# EAGLE schematic shinobi (EAGLE 9.6.2)
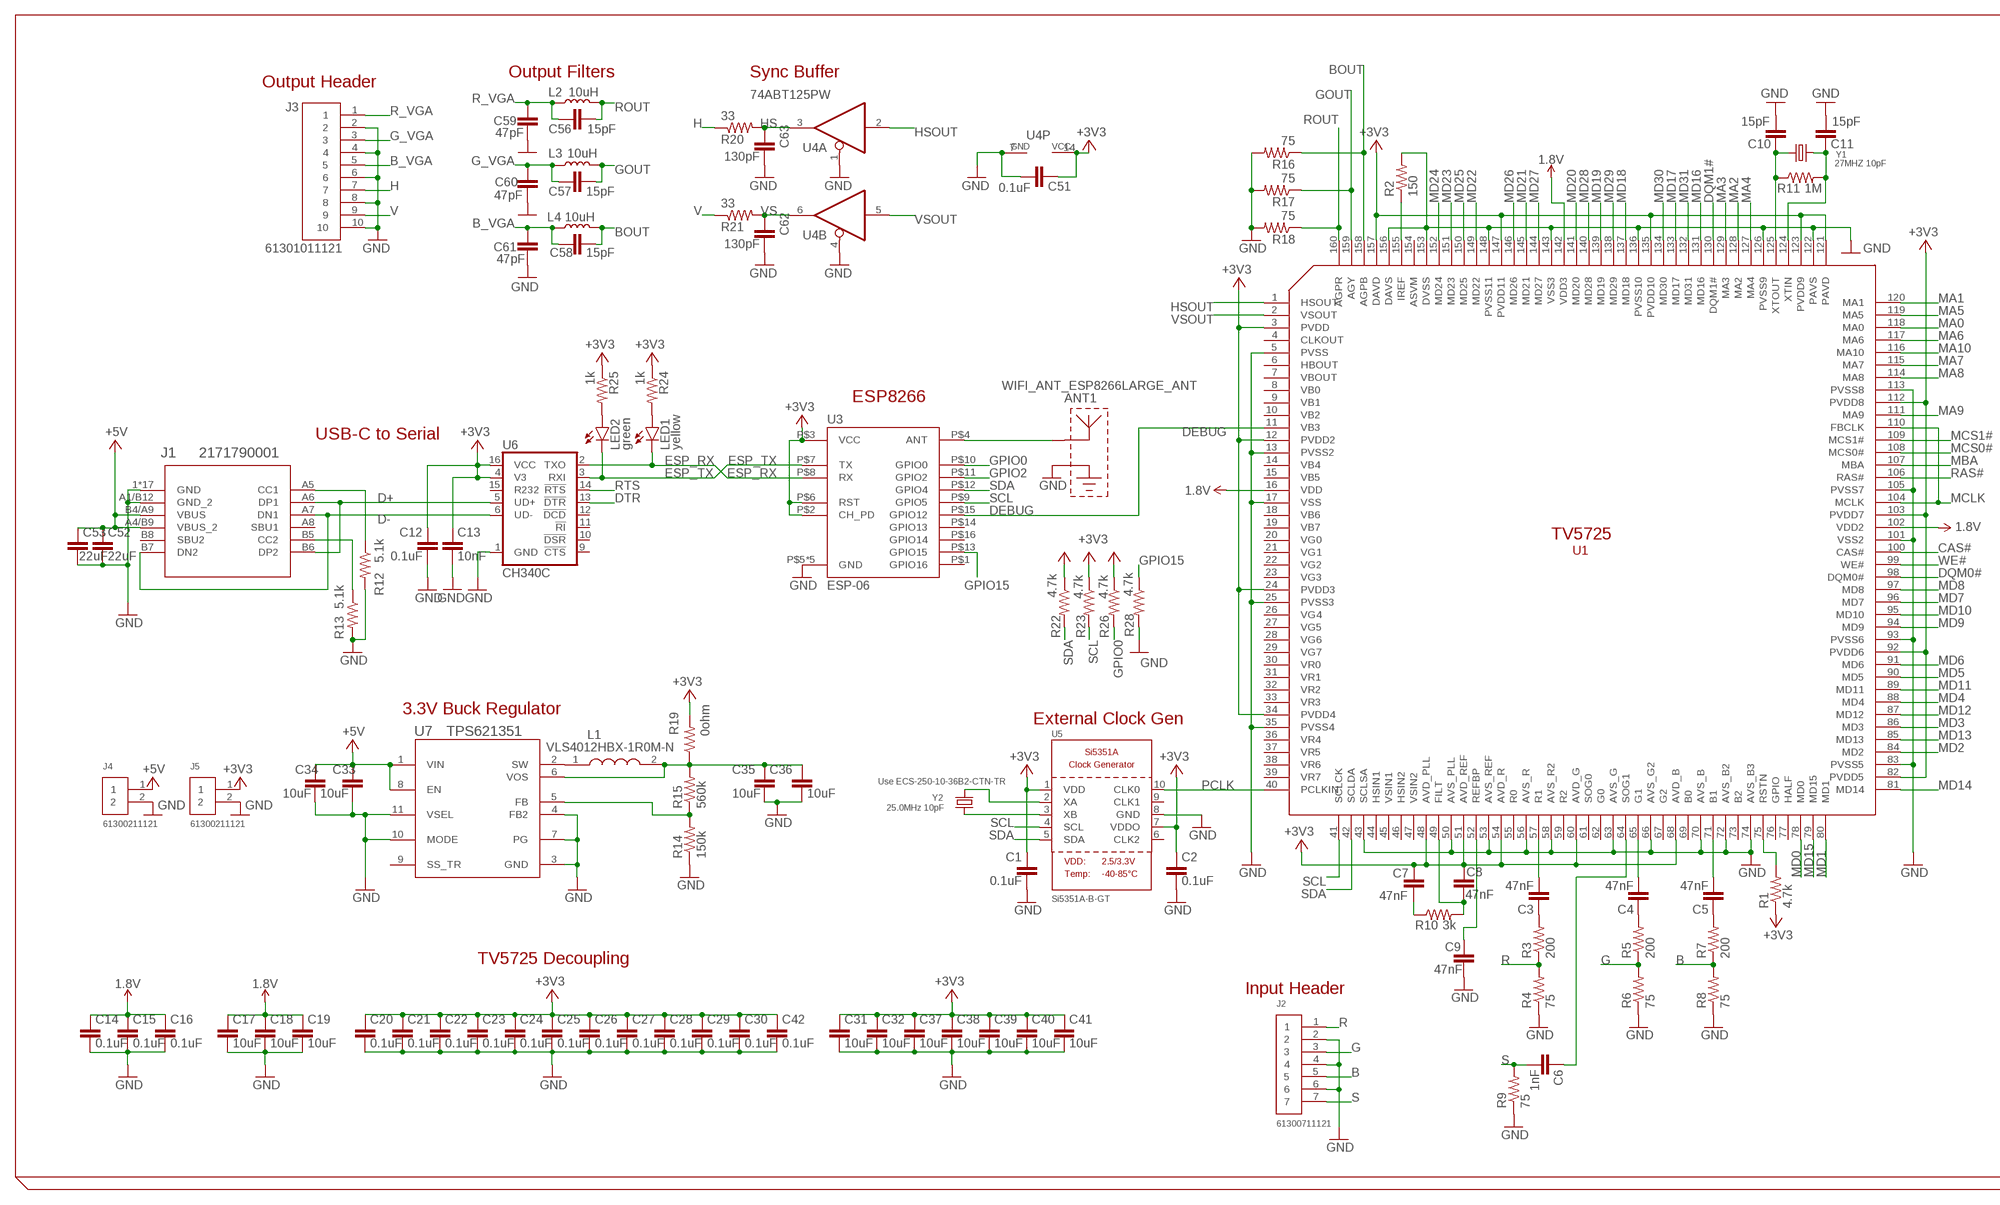
[diagram p0: schematic, sheet 1, part 1 of 2]
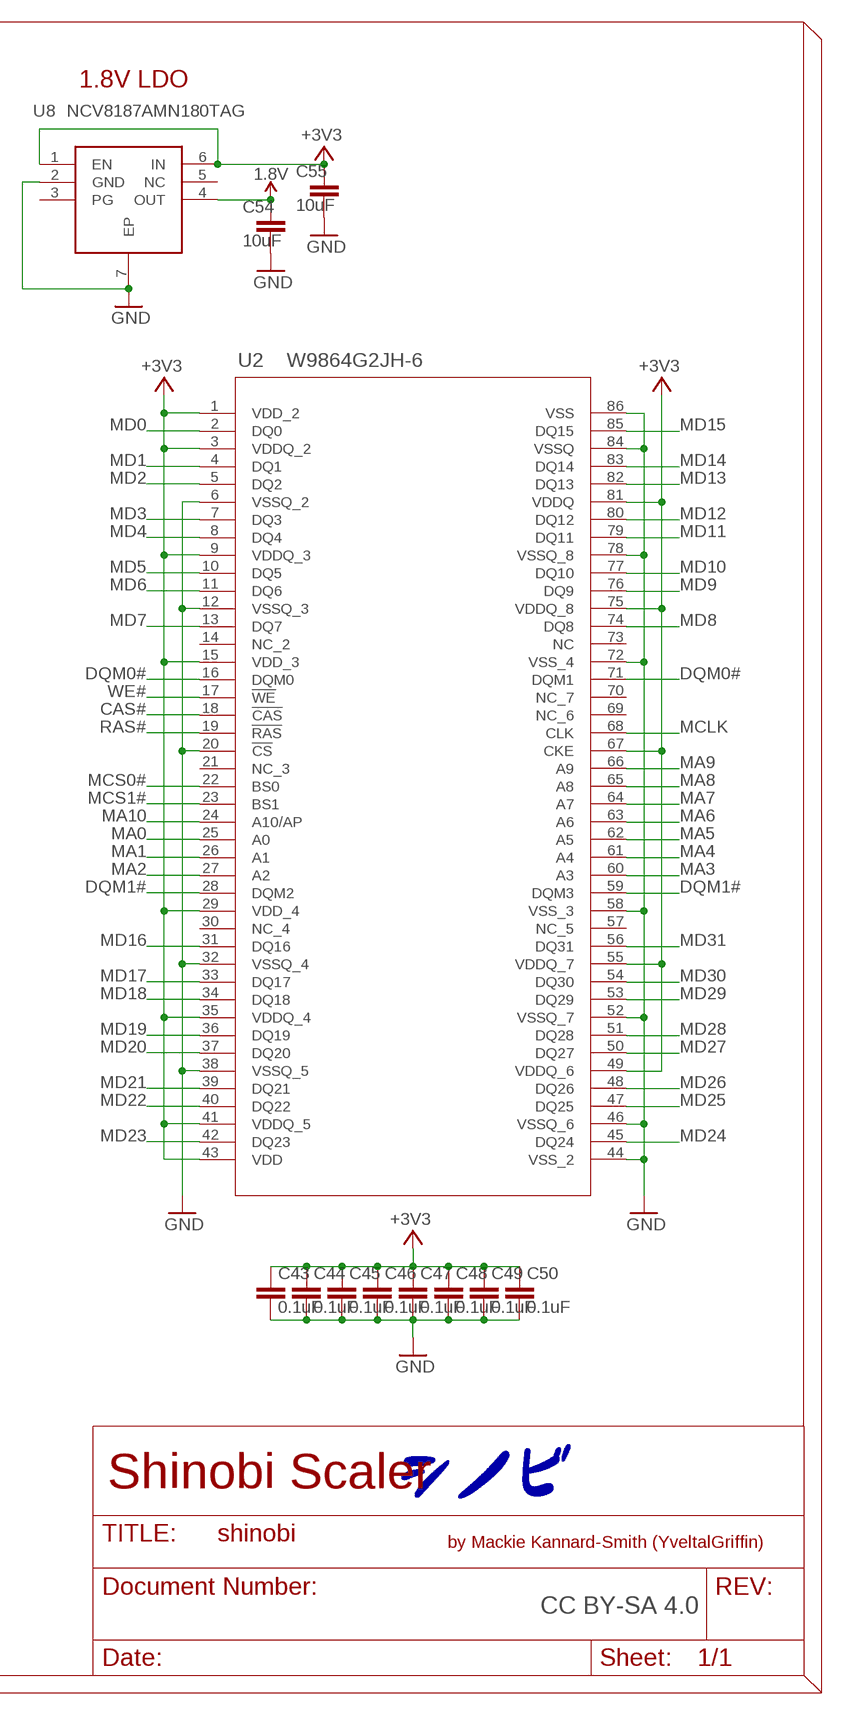
[diagram p1: schematic, sheet 1, part 2 of 2]

## Parts
ANT1  WIFI_ANT_ESP8266LARGE_ANT  [ANTENNA]
C1  0.1uF  C-USC0402  [C0402]
C2  0.1uF  C-USC0402  [C0402]
C3  47nF  C-USC0402  [C0402]
C4  47nF  C-USC0402  [C0402]
C5  47nF  C-USC0402  [C0402]
C6  1nF  C-USC0402  [C0402]
C7  47nF  C-USC0402  [C0402]
C8  47nF  C-USC0402  [C0402]
C9  47nF  C-USC0402  [C0402]
C10  15pF  C-USC0402  [C0402]
C11  15pF  C-USC0402  [C0402]
C12  0.1uF  C-USC0402  [C0402]
C13  10nF  C-USC0402  [C0402]
C14  0.1uF  C-USC0402  [C0402]
C15  0.1uF  C-USC0402  [C0402]
C16  0.1uF  C-USC0402  [C0402]
C17  10uF  C-USC0603  [C0603]
C18  10uF  C-USC0603  [C0603]
C19  10uF  C-USC0603  [C0603]
C20  0.1uF  C-USC0402  [C0402]
C21  0.1uF  C-USC0402  [C0402]
C22  0.1uF  C-USC0402  [C0402]
C23  0.1uF  C-USC0402  [C0402]
C24  0.1uF  C-USC0402  [C0402]
C25  0.1uF  C-USC0402  [C0402]
C26  0.1uF  C-USC0402  [C0402]
C27  0.1uF  C-USC0402  [C0402]
C28  0.1uF  C-USC0402  [C0402]
C29  0.1uF  C-USC0402  [C0402]
C30  0.1uF  C-USC0402  [C0402]
C31  10uF  C-USC0603  [C0603]
C32  10uF  C-USC0603  [C0603]
C33  10uF  C-USC0603  [C0603]
C34  10uF  C-USC0603  [C0603]
C35  10uF  C-USC0603  [C0603]
C36  10uF  C-USC0603  [C0603]
C37  10uF  C-USC0603  [C0603]
C38  10uF  C-USC0603  [C0603]
C39  10uF  C-USC0603  [C0603]
C40  10uF  C-USC0603  [C0603]
C41  10uF  C-USC0603  [C0603]
C42  0.1uF  C-USC0402  [C0402]
C43  0.1uF  C-USC0402  [C0402]
C44  0.1uF  C-USC0402  [C0402]
C45  0.1uF  C-USC0402  [C0402]
C46  0.1uF  C-USC0402  [C0402]
C47  0.1uF  C-USC0402  [C0402]
C48  0.1uF  C-USC0402  [C0402]
C49  0.1uF  C-USC0402  [C0402]
C50  0.1uF  C-USC0402  [C0402]
C51  0.1uF  C-USC0402  [C0402]
C52  22uF  C-USC0805  [C0805]
C53  22uF  C-USC0805  [C0805]
C54  10uF  C-USC0603  [C0603]
C55  10uF  C-USC0603  [C0603]
C56  15pF  C-USC0402  [C0402]
C57  15pF  C-USC0402  [C0402]
C58  15pF  C-USC0402  [C0402]
C59  47pF  C-USC0402  [C0402]
C60  47pF  C-USC0402  [C0402]
C61  47pF  C-USC0402  [C0402]
C62  130pF  C-USC0402  [C0402]
C63  130pF  C-USC0402  [C0402]
J1  2171790001  [2171790001_MOL]
J2  61300711121  [61300711121]
J3  61301011121  [61301011121]
J4  61300211121  [61300211121]
J5  61300211121  [61300211121]
L1  VLS4012HBX-1R0M-N  [VLS4012]
L2  10uH  L0402  [R0402]
L3  10uH  L0402  [R0402]
L4  10uH  L0402  [R0402]
LED1  yellow  LEDCHIP-LED0603  [CHIP-LED0603]
LED2  green  LEDCHIP-LED0603  [CHIP-LED0603]
R1  4.7k  R-US_R0402  [R0402]
R2  150  R-US_R0402  [R0402]
R3  200  R-US_R0402  [R0402]
R4  75  R-US_R0402  [R0402]
R5  200  R-US_R0402  [R0402]
R6  75  R-US_R0402  [R0402]
R7  200  R-US_R0402  [R0402]
R8  75  R-US_R0402  [R0402]
R9  75  R-US_R0402  [R0402]
R10  3k  R-US_R0402  [R0402]
R11  1M  R-US_R0402  [R0402]
R12  5.1k  R-US_R0402  [R0402]
R13  5.1k  R-US_R0402  [R0402]
R14  150k  R-US_R0402  [R0402]
R15  560k  R-US_R0402  [R0402]
R16  75  R-US_R0402  [R0402]
R17  75  R-US_R0402  [R0402]
R18  75  R-US_R0402  [R0402]
R19  0ohm  R-US_R0805  [R0805]
R20  33  R-US_R0402  [R0402]
R21  33  R-US_R0402  [R0402]
R22  4.7k  R-US_R0402  [R0402]
R23  4.7k  R-US_R0402  [R0402]
R24  1k  R-US_R0402  [R0402]
R25  1k  R-US_R0402  [R0402]
R26  4.7k  R-US_R0402  [R0402]
R28  4.7k  R-US_R0402  [R0402]
U1  TV5725  [PQFP160]
U2  W9864G2JH-6  [WIN_TSOP-86_WIN]
U3  ESP-06  [ESP-06]
U4  74ABT125PW  [TSSOP14]
U5  Si5351A-B-GT  SI5351A  [MSOP10]
U6  CH340C  [SO016]
U7  TPS621351  TPS621351RGXR  [RGX0011A]
U8  NCV8187AMN180TAG  [SON95P300X300X95-7N]
Y1  27MHZ 10pF  CRYSTAL2.5X2.0  [CRYSTAL_2.5X2]
Y2  25.0MHz 10pF  CRYSTAL2.5X2.0  [CRYSTAL_2.5X2]

## Nets
1.8V: C14.1 C15.1 C16.1 C17.1 C18.1 C19.1 C54.1 U1.16(VDD) U1.102(VDD2) U1.142(VDD3) U8.4(OUT)
+3V3: C1.1 C2.1 C7.2 C8.2 C12.1 C13.1 C20.1 C21.1 C22.1 C23.1 C24.1 C25.1 C26.1 C27.1 C28.1 C29.1 C30.1 C31.1 C32.1 C37.1 C38.1 C39.1 C40.1 C41.1 C42.1 C43.1 C44.1 C45.1 C46.1 C47.1 C48.1 C49.1 C50.1 C51.1 C55.1 J5.1 R1.1 R19.2 R22.1 R23.1 R24.1 R25.1 R26.1 U1.3(PVDD) U1.12(PVDD2) U1.24(PVDD3) U1.34(PVDD4) U1.48(AVD_PLL) U1.51(AVD_REF) U1.54(AVD_R) U1.60(AVD_G) U1.68(AVD_B) U1.82(PVDD5) U1.92(PVDD6) U1.103(PVDD7) U1.112(PVDD8) U1.121(PAVD) U1.123(PVDD9) U1.135(PVDD10) U1.147(PVDD11) U1.157(DAVD) U2.1(VDD_2) U2.3(VDDQ_2) U2.9(VDDQ_3) U2.15(VDD_3) U2.29(VDD_4) U2.35(VDDQ_4) U2.41(VDDQ_5) U2.43(VDD) U2.49(VDDQ_6) U2.55(VDDQ_7) U2.67(CKE) U2.75(VDDQ_8) U2.81(VDDQ) U3.P$2(CH_PD) U3.P$3(VCC) U3.P$6(RST) U4.14(P:VCC) U5.1(VDD) U5.7(VDDO) U6.4(V3) U6.16(VCC) U8.1(EN) U8.6(IN)
+5V: C33.1 C34.1 C52.1 C53.1 J1.A4/B9(VBUS_2) J1.B4/A9(VBUS) J4.1 U7.1(VIN) U7.8(EN)
ANT: ANT1.P$2(ANT) U3.P$4(ANT)
B: J2.5 R7.1 R8.2
B_VGA: C58.2 C61.1 J3.5 L4.2
BOUT: C58.1 L4.1 R16.1 U1.158(AGPB)
CAS#: U1.100(CAS#) U2.18(!CAS)
D+: J1.A6(DP1) J1.B6(DP2) U6.5(UD+)
D-: J1.A7(DN1) J1.B7(DN2) U6.6(UD-)
DEBUG: U1.11(VB3) U3.P$15(GPIO12)
DQM0#: U1.98(DQM0#) U2.16(DQM0) U2.71(DQM1)
DQM1#: U1.130(DQM1#) U2.28(DQM2) U2.59(DQM3)
DTR: U6.13(!DTR)
ESP_RX: LED1.C U3.P$8(RX) U6.2(TXO)
ESP_TX: LED2.C U3.P$7(TX) U6.3(RXI)
G: J2.3 R5.1 R6.2
G_VGA: C57.2 C60.1 J3.3 L3.2
GND: ANT1.P$1(GND) C1.2 C2.2 C9.1 C10.1 C11.1 C12.2 C13.2 C14.2 C15.2 C16.2 C17.2 C18.2 C19.2 C20.2 C21.2 C22.2 C23.2 C24.2 C25.2 C26.2 C27.2 C28.2 C29.2 C30.2 C31.2 C32.2 C33.2 C34.2 C35.2 C36.2 C37.2 C38.2 C39.2 C40.2 C41.2 C42.2 C43.2 C44.2 C45.2 C46.2 C47.2 C48.2 C49.2 C50.2 C51.2 C52.2 C53.2 C54.2 C55.2 C59.2 C60.2 C61.2 C62.2 C63.2 J1.1(GND) J1.2(GND) J1.3(GND) J1.4(GND) J1.13(GND) J1.14(GND) J1.15(GND) J1.16(GND) J1.A1/B12(GND_2) J1.B1/A12(GND) J1.S_1_H1(GND) J1.S_1_H2(GND) J1.S_2_H1(GND) J1.S_2_H2(GND) J1.S_3_H1(GND) J1.S_3_H2(GND) J1.S_4_H1(GND) J1.S_4_H2(GND) J2.2 J2.4 J2.6 J3.2 J3.4 J3.6 J3.8 J3.10 J4.2 J5.2 R2.2 R4.1 R6.1 R8.1 R9.1 R12.2 R13.2 R14.1 R16.2 R17.2 R18.2 R28.2 U1.5(PVSS) U1.13(PVSS2) U1.17(VSS) U1.25(PVSS3) U1.35(PVSS4) U1.43(SCLSA) U1.50(AVS_PLL) U1.53(AVS_REF) U1.56(AVS_R) U1.58(AVS_R2) U1.63(AVS_G) U1.66(AVS_G2) U1.70(AVS_B) U1.72(AVS_B2) U1.74(AVS_B3) U1.83(PVSS5) U1.93(PVSS6) U1.101(VSS2) U1.105(PVSS7) U1.113(PVSS8) U1.122(PAVS) U1.126(PVSS9) U1.136(PVSS10) U1.143(VSS3) U1.148(PVSS11) U1.153(DVSS) U1.156(DAVS) U2.6(VSSQ_2) U2.12(VSSQ_3) U2.20(!CS) U2.32(VSSQ_4) U2.38(VSSQ_5) U2.44(VSS_2) U2.46(VSSQ_6) U2.52(VSSQ_7) U2.58(VSS_3) U2.72(VSS_4) U2.78(VSSQ_8) U2.84(VSSQ) U2.86(VSS) U3.P$5(GND) U3.P$17(GND) U3.P$18(GND) U3.P$19(GND) U3.P$20(GND) U4.1(A:OE) U4.4(B:OE) U4.7(P:GND) U5.8(GND) U6.1(GND) U7.3(GND) U7.4(FB2) U7.7(PG) U7.10(MODE) U7.11(VSEL) U8.2(GND) U8.7(EP)
GOUT: C57.1 L3.1 R17.1 U1.159(AGY)
GPIO0: R26.2 U3.P$10(GPIO0)
GPIO2: U3.P$11(GPIO2)
GPIO15: R28.1 U3.P$13(GPIO15)
H: J3.7 R20.1
HS: C63.1 R20.2 U4.3(A:O)
HSOUT: U1.1(HSOUT) U4.2(A:I)
MA0: U1.118(MA0) U2.25(A0)
MA1: U1.120(MA1) U2.26(A1)
MA2: U1.128(MA2) U2.27(A2)
MA3: U1.129(MA3) U2.60(A3)
MA4: U1.127(MA4) U2.61(A4)
MA5: U1.119(MA5) U2.62(A5)
MA6: U1.117(MA6) U2.63(A6)
MA7: U1.115(MA7) U2.64(A7)
MA8: U1.114(MA8) U2.65(A8)
MA9: U1.111(MA9) U2.66(A9)
MA10: U1.116(MA10) U2.24(A10/AP)
MBA: U1.107(MBA)
MCLK: U1.104(MCLK) U1.110(FBCLK) U2.68(CLK)
MCS0#: U1.108(MCS0#) U2.22(BS0)
MCS1#: U1.109(MCS1#) U2.23(BS1)
MD0: U1.78(MD0) U2.2(DQ0)
MD1: U1.80(MD1) U2.4(DQ1)
MD2: U1.84(MD2) U2.5(DQ2)
MD3: U1.86(MD3) U2.7(DQ3)
MD4: U1.88(MD4) U2.8(DQ4)
MD5: U1.90(MD5) U2.10(DQ5)
MD6: U1.91(MD6) U2.11(DQ6)
MD7: U1.96(MD7) U2.13(DQ7)
MD8: U1.97(MD8) U2.74(DQ8)
MD9: U1.94(MD9) U2.76(DQ9)
MD10: U1.95(MD10) U2.77(DQ10)
MD11: U1.89(MD11) U2.79(DQ11)
MD12: U1.87(MD12) U2.80(DQ12)
MD13: U1.85(MD13) U2.82(DQ13)
MD14: U1.81(MD14) U2.83(DQ14)
MD15: U1.79(MD15) U2.85(DQ15)
MD16: U1.131(MD16) U2.31(DQ16)
MD17: U1.133(MD17) U2.33(DQ17)
MD18: U1.137(MD18) U2.34(DQ18)
MD19: U1.139(MD19) U2.36(DQ19)
MD20: U1.141(MD20) U2.37(DQ20)
MD21: U1.145(MD21) U2.39(DQ21)
MD22: U1.149(MD22) U2.40(DQ22)
MD23: U1.151(MD23) U2.42(DQ23)
MD24: U1.152(MD24) U2.45(DQ24)
MD25: U1.150(MD25) U2.47(DQ25)
MD26: U1.146(MD26) U2.48(DQ26)
MD27: U1.144(MD27) U2.50(DQ27)
MD28: U1.140(MD28) U2.51(DQ28)
MD29: U1.138(MD29) U2.53(DQ29)
MD30: U1.134(MD30) U2.54(DQ30)
MD31: U1.132(MD31) U2.56(DQ31)
N$1: U5.3(XB) Y2.1
N$2: U5.2(XA) Y2.3
N$3: R1.2 U1.75(RSTN)
N$4: R2.1 U1.155(IREF)
N$5: C3.1 R3.2
N$6: C10.2 R11.1 U1.125(XTOUT) Y1.1
N$7: C4.1 R5.2
N$8: C3.2 U1.57(R1)
N$9: C4.2 U1.65(G1)
N$10: C5.1 R7.2
N$11: C5.2 U1.71(B1)
N$12: C6.1 U1.64(SOG1)
N$13: C8.1 R10.2 U1.49(FILT)
N$14: C7.1 R10.1
N$15: C9.2 U1.52(REFBP)
N$16: C11.2 R11.2 U1.124(XTIN) Y1.3
N$17: L1.1 U7.2(SW)
N$18: R14.2 R15.1 U7.5(FB)
N$19: C35.1 C36.1 L1.2 R15.2 R19.1 U7.6(VOS)
N$20: LED1.A R24.2
N$23: J1.A5(CC1) R12.1
N$24: J1.B5(CC2) R13.1
N$25: LED2.A R25.2
PCLK: U1.40(PCLKIN) U5.10(CLK0)
R: J2.1 R3.1 R4.2
R_VGA: C56.2 C59.1 J3.1 L2.2
RAS#: U1.106(RAS#) U2.19(!RAS)
ROUT: C56.1 L2.1 R18.1 U1.160(AGPR)
RTS: U6.14(!RTS)
S: C6.2 J2.7 R9.2
SCL: R23.2 U1.41(SCLCK) U3.P$9(GPIO5) U5.4(SCL)
SDA: R22.2 U1.42(SCLDA) U3.P$12(GPIO4) U5.5(SDA)
V: J3.9 R21.1
VS: C62.1 R21.2 U4.6(B:O)
VSOUT: U1.2(VSOUT) U4.5(B:I)
WE#: U1.99(WE#) U2.17(!WE)
Unconnected: J1.A8(SBU1) J1.B8(SBU2) U1.4(CLKOUT) U1.6(HBOUT) U1.7(VBOUT) U1.8(VB0) U1.9(VB1) U1.10(VB2) U1.14(VB4) U1.15(VB5) U1.18(VB6) U1.19(VB7) U1.20(VG0) U1.21(VG1) U1.22(VG2) U1.23(VG3) U1.26(VG4) U1.27(VG5) U1.28(VG6) U1.29(VG7) U1.30(VR0) U1.31(VR1) U1.32(VR2) U1.33(VR3) U1.36(VR4) U1.37(VR5) U1.38(VR6) U1.39(VR7) U1.44(HSIN1) U1.45(VSIN1) U1.46(HSIN2) U1.47(VSIN2) U1.55(R0) U1.59(R2) U1.61(SOG0) U1.62(G0) U1.67(G2) U1.69(B0) U1.73(B2) U1.76(GPIO) U1.77(HALF) U1.154(ASVM) U2.14(NC_2) U2.21(NC_3) U2.30(NC_4) U2.57(NC_5) U2.69(NC_6) U2.70(NC_7) U2.73(NC) U3.P$1(GPIO16) U3.P$14(GPIO13) U3.P$16(GPIO14) U4.8(C:O) U4.9(C:I) U4.10(C:OE) U4.11(D:O) U4.12(D:I) U4.13(D:OE) U5.6(CLK2) U5.9(CLK1) U6.9(!CTS) U6.10(!DSR) U6.11(!RI) U6.12(!DCD) U6.15(R232) U7.9(SS_TR) U8.3(PG) U8.5(NC)

## Notes on the sheet
- 1.8V LDO
- Output Filters | Sync Buffer
- Output Header
- ESP8266
- USB-C to Serial
- U1
- 3.3V Buck Regulator
- External Clock Gen
- Use ECS-250-10-36B2-CTN-TR
- TV5725 Decoupling
- Input Header
- Shinobi Scaler
- by Mackie Kannard-Smith (YveltalGriffin)
- CC BY-SA 4.0

## Library data of the parts
ANT1 = personal:WIFI_ANT_ESP8266
C1-C63 = resistor:C-US: CAPACITOR, American symbol
J1 = personal:2171790001; COPYRIGHT: Copyright (C) 2022 Ultra Librarian. All rights reserved.; MANUFACTURER_PART_NUMBER: 2171790001; MFR_NAME: Molex Connector Corporation
J2 = Headers:61300711121: CONN HEADER VERT 7POS 2.54MM Manufacturer's datasheet <https://katalog.we-online.de/em/datasheet/6130xx11121.pdf>; CREATED_BY: PCBLayout.com; DIGI_KEY_PART_NUMBER: 732-5320-ND; MANUFACTURER: Wurth Electronics Inc.; MPN: 61300711121
J3 = Headers:61301011121: CONN HEADER VERT 10POS 2.54MM Manufacturer's datasheet <https://katalog.we-online.de/em/datasheet/6130xx11121.pdf>; CREATED_BY: PCBLayout.com; DIGIKEY_PART_NUMBER: 732-2670-ND; MANUFACTURER: Wurth Electronics Inc.; MPN: 61301011121
J4 J5 = Headers:61300211121: CONN HEADER VERT 2POS 2.54MM Manufacturer's datasheet <https://katalog.we-online.de/em/datasheet/6130xx11121.pdf>; CREATED_BY: PCBLayout.com; DIGI_KEY_PART_NUMBER: 732-5315-ND; MANUFACTURER: Wurth Electronics Inc.; MPN: 61300211121
L1 = SamacSys_Parts:VLS4012HBX-1R0M-N: SMD / SMT Inductors (Coils), L=1?H, L x W x T : Source: Datasheet <https://product.tdk.com/system/files/dam/doc/product/inductor/inductor/smd/catalog/inductor_commercial_power_vls4012hbx_en.pdf>; DESCRIPTION: SMD / SMT Inductors (Coils), L=1?H, L x W x T :; HEIGHT: mm; MANUFACTURER_NAME: TDK; MANUFACTURER_PART_NUMBER: VLS4012HBX-1R0M-N; MOUSER_PART_NUMBER: 810-VLS4012HBX1R0M-N; MOUSER_PRICE-STOCK: https://www.mouser.co.uk/ProductDetail/TDK/VLS4012HBX-1R0M-N?qs=A6eO%252BMLsxmRj5Q%2FVkECdLg%3D%3D
L2-L4 = resistor:L0402
LED1 LED2 = led:LED: LED OSRAM: - CHIPLED LG R971, LG N971, LY N971, LG Q971, LY Q971, LO R971, LY R971 LH N974, LH R974 LS Q976, LO Q976, LY Q976 LO Q996 - Hyper CHIPLED LW Q18S LB Q993, LB Q99A, LB R99A - SideLED LS A670, LO A670, LY A670, LG A670, LP A670 LB A673, LV A673, LT A673, LW A673 LH A674 LY A675 LS A676, LA A676, LO A676, LY A676, LW A676 LS A679, LY A679, LG A679 - Hyper Micro SIDELED® LS Y876, LA Y876, LO Y876, LY Y876 LT Y87S - SmartLED LW L88C, LW L88S LB L89C, LB L89S, LG L890 LS L89K, LO L89K, LY L89K LS L896, LA L896, LO L896, LY L896 - TOPLED LS T670, LO T670, LY T670, LG T670, LP T670 LSG T670, LSP T670, LSY T670, LOP T670, LYG T670 LG T671, LOG T671, LSG T671 LB T673, LV T673, LT T673, LW T673 LH T674 LS T676, LA T676, LO T676, LY T676, LB T676, LH T676, LSB T676, LW T676 LB T67C, LV T67C, LT T67C, LS T67K, LO T67K, LY T67K, LW E67C LS E67B, LA E67B, LO E67B, LY E67B, LB E67C, LV E67C, LT E67C LW T67C LS T679, LY T679, LG T679 LS T770, LO T770, LY T770, LG T770, LP T770 LB T773, LV T773, LT T773, LW T773 LH T774 LS E675, LA E675, LY E675, LS T675 LS T776, LA T776, LO T776, LY T776, LB T776 LHGB T686 LT T68C, LB T68C - Hyper Mini TOPLED® LB M676 - Mini TOPLED Santana® LG M470 LS M47K, LO M47K, LY M47K Source: http://www.osram.convergy.de LUXEON: - LUMILED® LXK2-PW12-R00, LXK2-PW12-S00, LXK2-PW14-U00, LXK2-PW14-V00 LXK2-PM12-R00, LXK2-PM12-S00, LXK2-PM14-U00 LXK2-PE12-Q00, LXK2-PE12-R00, LXK2-PE12-S00, LXK2-PE14-T00, LXK2-PE14-U00 LXK2-PB12-K00, LXK2-PB12-L00, LXK2-PB12-M00, LXK2-PB14-N00, LXK2-PB14-P00, LXK2-PB14-Q00 LXK2-PR12-L00, LXK2-PR12-M00, LXK2-PR14-Q00, LXK2-PR14-R00 LXK2-PD12-Q00, LXK2-PD12-R00, LXK2-PD12-S00 LXK2-PH12-R00, LXK2-PH12-S00 LXK2-PL12-P00, LXK2-PL12-Q00, LXK2-PL12-R00 Source: www.luxeon.com KINGBRIGHT: KA-3528ASYC Source: www.kingbright.com
R1-R26 R28 = resistor:R-US_: RESISTOR, American symbol
U1 = personal:TV5725
U2 = personal:W9864G2JH-6; COPYRIGHT: Copyright (C) 2022 Ultra Librarian. All rights reserved.; MANUFACTURER_PART_NUMBER: W9864G2JH-6; MFR_NAME: Winbond
U3 = personal:ESP-06
U4 = 74xx-eu:74*125: Quad bus BUFFER, 3-state
U5 = microbuilder:SI5351A: Si5351A 8kHz-160MHz I2C Clock Generator VDD: 2.5V or 3.3V Input Range: 25MHz or 27MHz XTAL User selectable internal input load capacitors: 6, 8 or 10 pF Output Impedance: 85 Ohm Output Load Capacitance: 5-15pF Operating Temperature: -40°C - 85°C Operating Current (3 outputs): 35mA Output buffer voltage (VDDO): 1.8, 2.5 or 3.3V Note: If VDDO is not used it should be connected to VDD. Unused clock out pins should be left floating.
U6 = SparkFun-IC-Comms:CH340C; PROD_ID: IC-14038
U7 = tps621351:TPS621351RGXR; MANUFACTURER: Texas Instruments; MANUFACTURER_NAME: Texas Instruments; MANUFACTURER_PART_NUMBER: TPS621351RGXR; PARTNUMBER: TPS621351RGXR; REFDES: RefDes; TYPE: TYPE; VALUE: Value
U8 = SamacSys_Parts:NCV8187AMN180TAG: LDO Voltage Regulators 1.2 A LOW IQ, LOW DROPOUT Source: Datasheet <https://componentsearchengine.com/Datasheets/2/NCV8187AMN180TAG.pdf>; DESCRIPTION: LDO Voltage Regulators 1.2 A LOW IQ, LOW DROPOUT; HEIGHT: 0.95mm; MANUFACTURER_NAME: onsemi; MANUFACTURER_PART_NUMBER: NCV8187AMN180TAG; MOUSER_PART_NUMBER: 863-NCV8187AMN180TAG; MOUSER_PRICE-STOCK: https://www.mouser.co.uk/ProductDetail/onsemi/NCV8187AMN180TAG?qs=%252B6g0mu59x7IXrWF3QtkYYQ%3D%3D
Y1 Y2 = microbuilder:CRYSTAL: Crystals HC49UP - Surface Mount Crystal 4.0MHz 18pF +/-30ppm Surface Mount Crystal [Digikey: 535-9857-1-ND] 12.0 MHz Surface Mount Crystal [Digikey: 535-9869-6-ND] 25.0 MHz Surface Mount Crystal [Digikey: 535-9078-1-ND] 2.5 x 2.0mm - MEMs SMT Crystal 16.0 MHz 10pF 20ppm 2.5 x 2.0mm Crystal [Digikey -40-85°C: 535-10923-1-ND] 3.2 x 2.5mm - MEMs SMT Crystal 12.0 MHz 8pF 15ppm 3.2 x 2.5mm Crystal [Digikey: -10-70°C: 644-1047-1-ND -40-125°C: 644-1128-1-ND] 40~85°C cheaper: 644-1173-6-ND 16.0 MHz 8pF 15ppm 3.2 x 2.5mm Crystal [Digikey: -10-70°C: 644-1049-1-ND -40-125°C: 644-1129-2-ND]-40~85°C cheaper: 644-1175-6-ND 16.0 MHz 10pF 10ppm 3.2 x 2.5mm Crystal [Digikey: 644-1100-1-ND] 27.12 MHz 18pF 30ppm 3.2 x 2.5mm Crystal [Digikey: 887-1424-1-ND] 27.12MHz 10pF 10ppm 3.2 x 2.5mm Crystal [Digikey: 887-1329-1-ND] 4.9 x 1.8mm - MEMs SMT Crystal 32.768 KHz 12.5pF 20ppm 4.9 x 1.8mm Crystal [Digikey: SE2415CT-ND] 8.0 x 3.8mm - Surface Mount Crystal 32.768kHz 12.5pF 20ppm -40°C-85°C [Digikey: 535-9166-2-ND] Cylinder 32.768KHz Cylinder Crystal (2x6mm body) [Ex. Digikey: 300-8341-2-ND]

## Net classes
1 power: width 0.305 mm